# Altium project CCDebugger_Adapater.PrjPcb
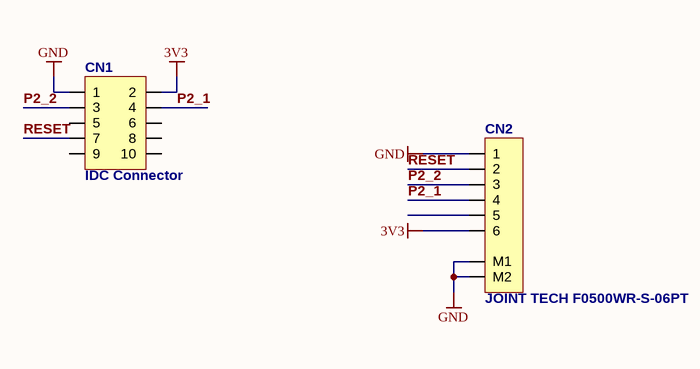
[diagram p0: sch.SchDoc]
1 sheet, 2 parts. Net scope: global (net labels, ports and power ports of the same name join across sheets).
Board file: pcb.PcbDoc

## Sheet sch.SchDoc: X
size A4; Date: DD-MM-YYYY; CheckedBy: X; DrawnBy: Y; Revision: 0.0.0; SheetNumber: X; SheetTotal: Y; Projectnumber: OWN-000; Size: A4; Projectname: X

### Parts
CN1  IDC Connector  [IDC10]
CN2  JOINT TECH F0500WR-S-06PT  [F0500WR-S-06PT]

### Nets
3V3: CN1.2 CN2.6
GND: CN1.1 CN2.1 CN2.9(M1) CN2.10(M2)
P2_1: CN1.4 CN2.4
P2_2: CN1.3 CN2.3
RESET: CN1.7 CN2.2

Not connected (* = marked no-connect by the designer): CN1 5 6 8 9 10; CN2 5

### Notes on the sheet
- PROJECT NAME:
- PROJECT NO.:
- DATE:
- TITLE:
- SHEET
- of
- DRAWN BY:
- REVISION:
- FILENAME:
- A4

### Library data of the parts
CN1 = CN_5x2
CN2 = JOINT TECH F0500WR-S-06PT: 0.50mm Pitch FFC/FPC Connector, SMT, Right Angle, ZIF, Top Contact Style Receptacle, 6 Circuits